# Altium project FPAA_minidev.PrjPcb
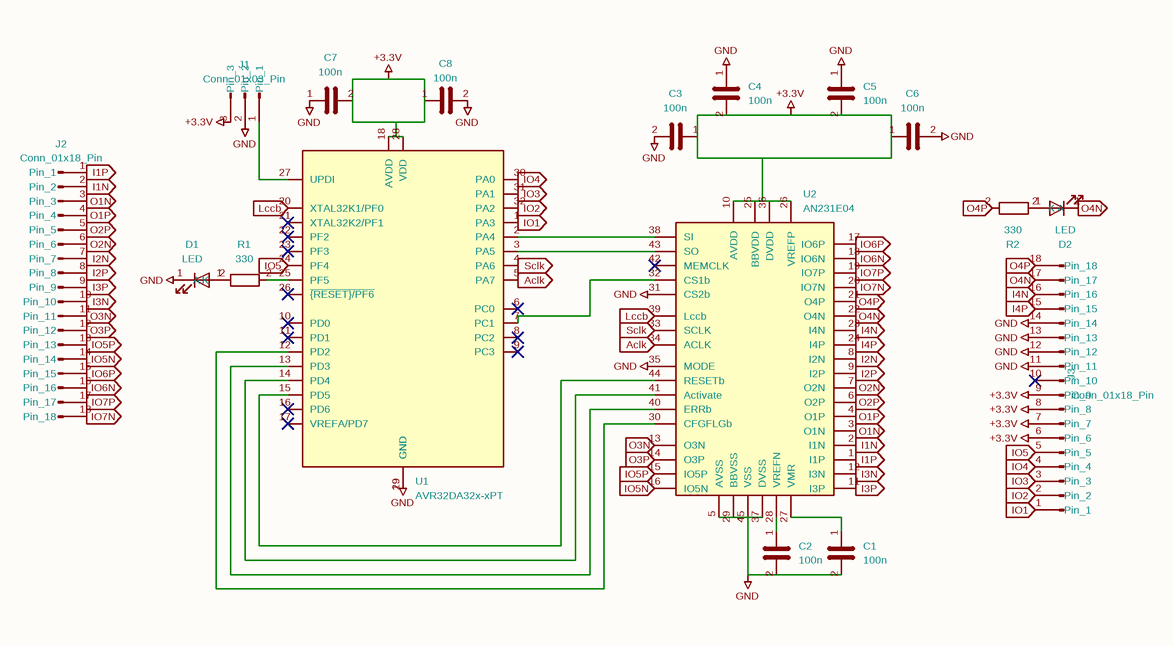
[diagram p0: FPAA_minidev.SchDoc]
1 sheet, 17 parts. Net scope: flat (ports and power ports of the same name join across sheets).
Board files: FPAA_minidev.PcbDoc, FPAA_minidev(1).PcbDoc

## Sheet FPAA_minidev.SchDoc
size 297 x 209 mm

### Parts
C1  100n  [C_0603_1608Metric]
C2  100n  [C_0603_1608Metric]
C3  100n  [C_0603_1608Metric]
C4  100n  [C_0603_1608Metric]
C5  100n  [C_0603_1608Metric]
C6  100n  [C_0603_1608Metric]
C7  100n  [C_0603_1608Metric]
C8  100n  [C_0603_1608Metric]
D1  LED  [LED_0603_1608Metric]
D2  LED  [LED_0603_1608Metric]
J1  Conn_01x03_Pin  [PinHeader_1x03_P2.54mm_Vertical]
J2  Conn_01x18_Pin  [PinHeader_1x18_P2.54mm_Vertical]
J3  Conn_01x18_Pin  [PinHeader_1x18_P2.54mm_Vertical]
R1  330  [C_0603_1608Metric]
R2  330  [C_0603_1608Metric]
U1  AVR32DA32x-xPT  [TQFP-32_7x7mm_P0.8mm]
U2  AN231E04  [QFN-44-1EP_9x9mm_P0.65mm_EP7.5x7.5mm]

### Ports
Aclk (in), I1N (in), I1P (in), I2N (in), I2P (in), I3N (in), I3P (in), I4N (in), I4P (in), IO1 (in), IO2 (in), IO3 (in), IO4 (in), IO5 (in), IO5N (in), IO5P (in), IO6N (in), IO6P (in), IO7N (in), IO7P (in), Lccb (in), O1N (in), O1P (in), O2N (in), O2P (in), O3N (in), O3P (in), O4N (in), O4P (in), Sclk (in)

### Nets
+3.3V: C3.1 C4.2 C5.2 C6.1 C7.2 C8.1 J1.3(Pin_3) J3.6(Pin_6) J3.7(Pin_7) J3.8(Pin_8) J3.9(Pin_9) U1.18(AVDD) U1.28(VDD) U2.10(AVDD) U2.25(BBVDD) U2.26(VREFP) U2.36(DVDD)
GND: C1.2 C2.2 C3.2 C4.1 C5.1 C6.2 C7.1 C8.2 D1.1(K) J1.2(Pin_2) J3.11(Pin_11) J3.12(Pin_12) J3.13(Pin_13) J3.14(Pin_14) U1.19(GND) U1.29(GND) U2.5(AVSS) U2.29(BBVSS) U2.31(CS2b) U2.35(MODE) U2.37(DVSS) U2.45(VSS)
Aclk: U1.5(PA7) U2.34(ACLK) ; port Aclk
I1N: J2.2(Pin_2) U2.2(I1N) ; port I1N
I1P: J2.1(Pin_1) U2.1(I1P) ; port I1P
I2N: J2.7(Pin_7) U2.8(I2N) ; port I2N
I2P: J2.8(Pin_8) U2.9(I2P) ; port I2P
I3N: J2.10(Pin_10) U2.12(I3N) ; port I3N
I3P: J2.9(Pin_9) U2.11(I3P) ; port I3P
I4N: J3.16(Pin_16) U2.23(I4N) ; port I4N
I4P: J3.15(Pin_15) U2.24(I4P) ; port I4P
IO1: J3.1(Pin_1) U1.1(PA3) ; port IO1
IO2: J3.2(Pin_2) U1.32(PA2) ; port IO2
IO3: J3.3(Pin_3) U1.31(PA1) ; port IO3
IO4: J3.4(Pin_4) U1.30(PA0) ; port IO4
IO5: J3.5(Pin_5) U1.24(PF4) ; port IO5
IO5N: J2.14(Pin_14) U2.16(IO5N) ; port IO5N
IO5P: J2.13(Pin_13) U2.15(IO5P) ; port IO5P
IO6N: J2.16(Pin_16) U2.18(IO6N) ; port IO6N
IO6P: J2.15(Pin_15) U2.17(IO6P) ; port IO6P
IO7N: J2.18(Pin_18) U2.20(IO7N) ; port IO7N
IO7P: J2.17(Pin_17) U2.19(IO7P) ; port IO7P
Lccb: U1.20(XTAL32K1/PF0) U2.39(Lccb) ; port Lccb
O1N: J2.3(Pin_3) U2.3(O1N) ; port O1N
O1P: J2.4(Pin_4) U2.4(O1P) ; port O1P
O2N: J2.6(Pin_6) U2.7(O2N) ; port O2N
O2P: J2.5(Pin_5) U2.6(O2P) ; port O2P
O3N: J2.11(Pin_11) U2.13(O3N) ; port O3N
O3P: J2.12(Pin_12) U2.14(O3P) ; port O3P
O4N: D2.1(K) J3.17(Pin_17) U2.22(O4N) ; port O4N
O4P: J3.18(Pin_18) R2.2 U2.21(O4P) ; port O4P
Sclk: U1.4(PA6) U2.33(SCLK) ; port Sclk
NetC1_1: C1.1 U2.27(VMR)
NetC2_1: C2.1 U2.28(VREFN)
NetD1_2: D1.2(A) R1.1
NetD2_2: D2.2(A) R2.1
NetJ1_1: J1.1(Pin_1) U1.27(UPDI)
NetR1_2: R1.2 U1.25(PF5)
NetU1_2: U1.2(PA4) U2.38(SI)
NetU1_3: U1.3(PA5) U2.43(SO)
NetU1_7: U1.7(PC1) U2.32(CS1b)
NetU1_12: U1.12(PD2) U2.30(CFGFLGb)
NetU1_13: U1.13(PD3) U2.40(ERRb)
NetU1_14: U1.14(PD4) U2.41(Activate)
NetU1_15: U1.15(PD5) U2.44(RESETb)

Not connected (* = marked no-connect by the designer): J3 10(Pin_10)*; U1 6(PC0)* 8(PC2)* 9(PC3)* 10(PD0)* 11(PD1)* 16(PD6)* 17(VREFA/PD7)* 21(XTAL32K2/PF1)* 22(PF2)* 23(PF3)* 26(~{{RESET}/PF6})*; U2 42(MEMCLK)*

### Notes on the sheet
- 1
- 2
- 3
- 4
- 5
- 6
- A
- B
- C
- D
- Title:
- File: FPAA_minidev.kicad_sch
- Sheet: /
- KiCad E.D.A.  kicad (5.1.4)-1
- Size: A4
- Date:
- Rev:
- Id: 1/1

### Library data of the parts
C1-C8 = C: Description: Unpolarized capacitor; Value: 100n; Footprint: Capacitor_SMD:C_0603_1608Metric
D1 D2 = LED: Description: Light emitting diode; Sim.Pins: 1=K 2=A; Value: LED; Footprint: LED_SMD:LED_0603_1608Metric
J1 = Conn_01x03_Pin: Description: Generic connector, single row, 01x03, script generated; Value: Conn_01x03_Pin; Footprint: Connector_PinHeader_2.54mm:PinHeader_1x03_P2.54mm_Vertical
J2 J3 = Conn_01x18_Pin: Description: Generic connector, single row, 01x18, script generated; Value: Conn_01x18_Pin; Footprint: Connector_PinHeader_2.54mm:PinHeader_1x18_P2.54mm_Vertical
R1 R2 = R: Description: Resistor; Value: 330; Footprint: Capacitor_SMD:C_0603_1608Metric
U1 = AVR32DA32x-xPT: Description: 24MHz, 32kB Flash, 4kB SRAM, EEPROM with Touch Sensing, TQFP-32; Value: AVR32DA32x-xPT; Footprint: Package_QFP:TQFP-32_7x7mm_P0.8mm
U2 = P8X32A-M44: Description: Parallax Propeller 8 core, 32 bit, 80 MHz microcontroller, 3.3VDC, 44-pin QFN; Value: AN231E04; Footprint: Package_DFN_QFN:QFN-44-1EP_9x9mm_P0.65mm_EP7.5x7.5mm